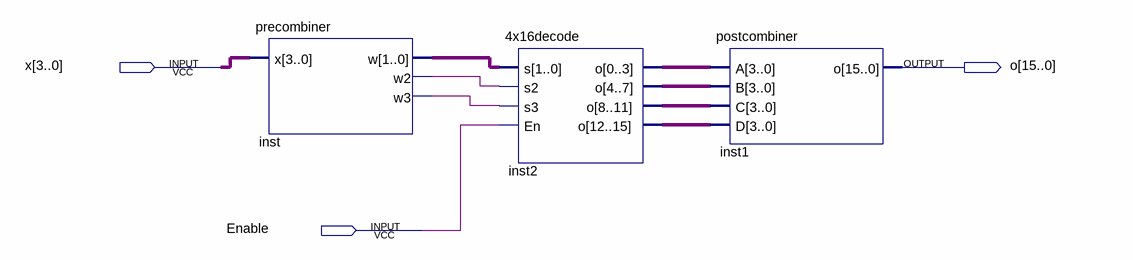
[diagram p0: schematic sheet]
// Quartus schematic 4x16.bdf as structural Verilog: 3 symbols, 3 pins
module \4x16  (
  input  [3:0] x,
  input  Enable,
  output [15:0] o
);

  wire inst_w2, inst_w3;
  wire [1:0] inst_w;
  wire [3:0] inst2_o, inst2_o_2, inst2_o_3, inst2_o_4;

  precombiner inst (.x(x), .w(inst_w), .w2(inst_w2), .w3(inst_w3));
  \4x16decode  inst2 (
    .s(inst_w), .s2(inst_w2), .s3(inst_w3), .En(Enable),
    .o({inst2_o_4[0], inst2_o_4[1], inst2_o_4[2], inst2_o_4[3], inst2_o_3[0], inst2_o_3[1], inst2_o_3[2], inst2_o_3[3], inst2_o_2[0], inst2_o_2[1], inst2_o_2[2], inst2_o_2[3], inst2_o[0], inst2_o[1], inst2_o[2], inst2_o[3]}));
  postcombiner inst1 (.A(inst2_o), .B(inst2_o_2), .C(inst2_o_3), .D(inst2_o_4), .o(o));
endmodule
